# EAGLE design voce-v2b-th (EAGLE 6.6.0)
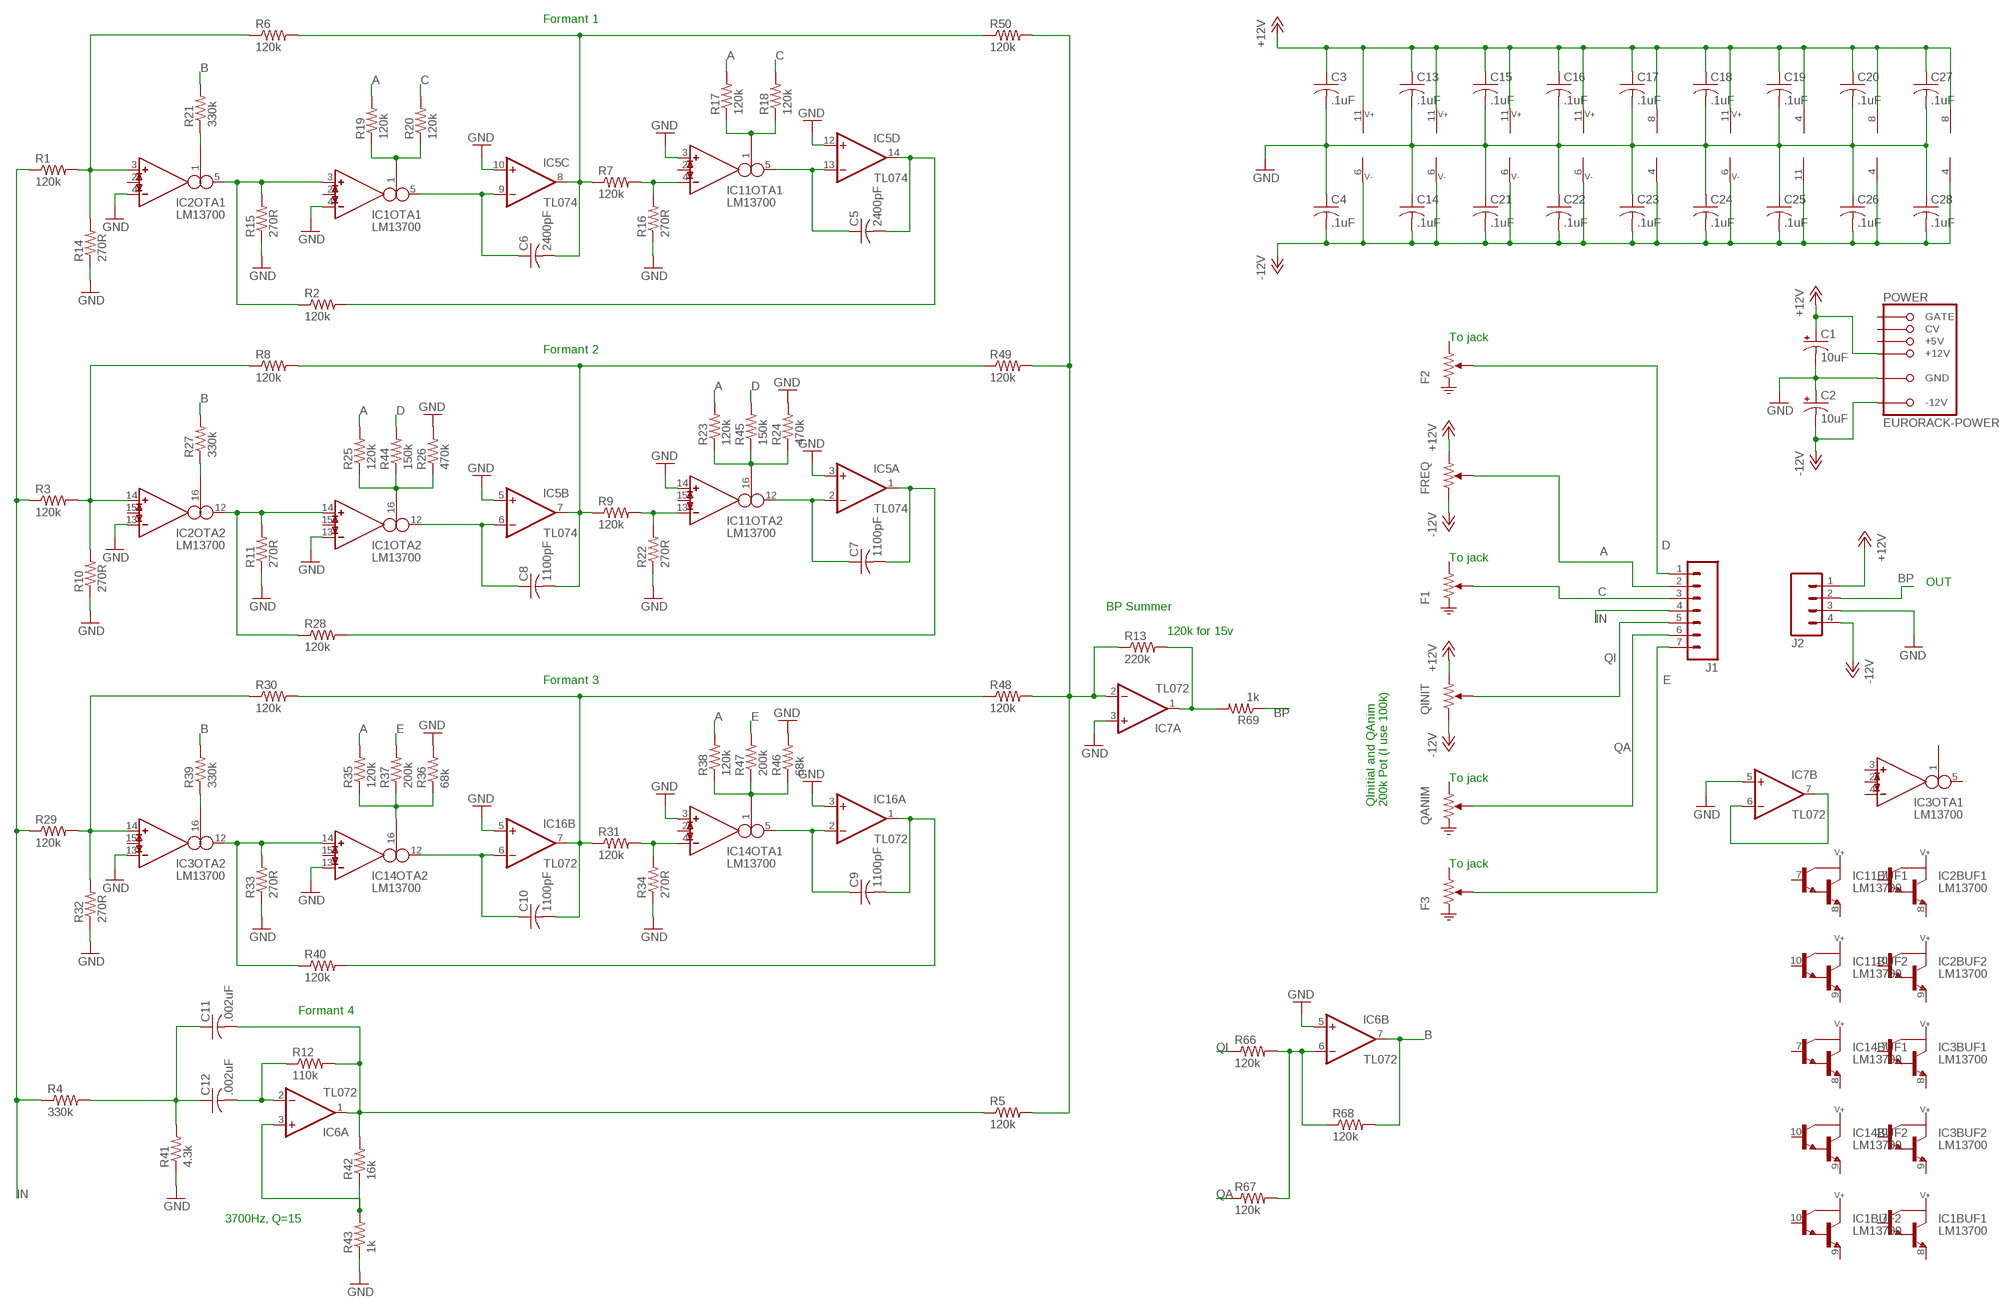
[diagram p0: schematic, sheet 1]

## Parts
C1  10uF  CPOL-USE2.5-5  [E2,5-5]
C2  10uF  CPOL-USE2.5-5  [E2,5-5]
C3  .1uF  C-US025-025X050  [C025-025X050]
C4  .1uF  C-US025-025X050  [C025-025X050]
C5  2400pF  C-US050-025X075  [C050-025X075]
C6  2400pF  C-US050-025X075  [C050-025X075]
C7  1100pF  C-US050-025X075  [C050-025X075]
C8  1100pF  C-US050-025X075  [C050-025X075]
C9  1100pF  C-US050-025X075  [C050-025X075]
C10  1100pF  C-US050-025X075  [C050-025X075]
C11  .002uF  C-US050-025X075  [C050-025X075]
C12  .002uF  C-US050-025X075  [C050-025X075]
C13  .1uF  C-US025-025X050  [C025-025X050]
C14  .1uF  C-US025-025X050  [C025-025X050]
C15  .1uF  C-US025-025X050  [C025-025X050]
C16  .1uF  C-US025-025X050  [C025-025X050]
C17  .1uF  C-US025-025X050  [C025-025X050]
C18  .1uF  C-US025-025X050  [C025-025X050]
C19  .1uF  C-US025-025X050  [C025-025X050]
C20  .1uF  C-US025-025X050  [C025-025X050]
C21  .1uF  C-US025-025X050  [C025-025X050]
C22  .1uF  C-US025-025X050  [C025-025X050]
C23  .1uF  C-US025-025X050  [C025-025X050]
C24  .1uF  C-US025-025X050  [C025-025X050]
C25  .1uF  C-US025-025X050  [C025-025X050]
C26  .1uF  C-US025-025X050  [C025-025X050]
C27  .1uF  C-US025-025X050  [C025-025X050]
C28  .1uF  C-US025-025X050  [C025-025X050]
F1  POT-ATTEN  (no package)
F2  POT-ATTEN  (no package)
F3  POT-ATTEN  (no package)
FREQ  POT  (no package)
IC1  LM13700  LM13700N  [DIL16]
IC2  LM13700  LM13700N  [DIL16]
IC3  LM13700  LM13700N  [DIL16]
IC5  TL074  TL074P  [DIL14]
IC6  TL072  TL072P  [DIL08]
IC7  TL072  TL072P  [DIL08]
IC11  LM13700  LM13700N  [DIL16]
IC14  LM13700  LM13700N  [DIL16]
IC16  TL072  TL072P  [DIL08]
J1  M07LONGPADS  [1X07_LONGPADS]
J2  M04LONGPADS  [1X04_LONGPADS]
POWER  EURORACK-POWER  [PINSHRD_PTH_2X8]
QANIM  POT-ATTEN  (no package)
QINIT  POT  (no package)
R1  120k  R-US_0204/2V  [0204V]
R2  120k  R-US_0204/2V  [0204V]
R3  120k  R-US_0204/2V  [0204V]
R4  330k  R-US_0204/2V  [0204V]
R5  120k  R-US_0204/2V  [0204V]
R6  120k  R-US_0204/2V  [0204V]
R7  120k  R-US_0204/2V  [0204V]
R8  120k  R-US_0204/2V  [0204V]
R9  120k  R-US_0204/2V  [0204V]
R10  270R  R-US_0204/2V  [0204V]
R11  270R  R-US_0204/2V  [0204V]
R12  110k  R-US_0204/2V  [0204V]
R13  220k  R-US_0204/2V  [0204V]
R14  270R  R-US_0204/2V  [0204V]
R15  270R  R-US_0204/2V  [0204V]
R16  270R  R-US_0204/2V  [0204V]
R17  120k  R-US_0204/2V  [0204V]
R18  120k  R-US_0204/2V  [0204V]
R19  120k  R-US_0204/2V  [0204V]
R20  120k  R-US_0204/2V  [0204V]
R21  330k  R-US_0204/2V  [0204V]
R22  270R  R-US_0204/2V  [0204V]
R23  120k  R-US_0204/2V  [0204V]
R24  470k  R-US_0204/2V  [0204V]
R25  120k  R-US_0204/2V  [0204V]
R26  470k  R-US_0204/2V  [0204V]
R27  330k  R-US_0204/2V  [0204V]
R28  120k  R-US_0204/2V  [0204V]
R29  120k  R-US_0204/2V  [0204V]
R30  120k  R-US_0204/2V  [0204V]
R31  120k  R-US_0204/2V  [0204V]
R32  270R  R-US_0204/2V  [0204V]
R33  270R  R-US_0204/2V  [0204V]
R34  270R  R-US_0204/2V  [0204V]
R35  120k  R-US_0204/2V  [0204V]
R36  68k  R-US_0204/2V  [0204V]
R37  200k  R-US_0204/2V  [0204V]
R38  120k  R-US_0204/2V  [0204V]
R39  330k  R-US_0204/2V  [0204V]
R40  120k  R-US_0204/2V  [0204V]
R41  4.3k  R-US_0204/2V  [0204V]
R42  16k  R-US_0204/2V  [0204V]
R43  1k  R-US_0204/2V  [0204V]
R44  150k  R-US_0204/2V  [0204V]
R45  150k  R-US_0204/2V  [0204V]
R46  68k  R-US_0204/2V  [0204V]
R47  200k  R-US_0204/2V  [0204V]
R48  120k  R-US_0204/2V  [0204V]
R49  120k  R-US_0204/2V  [0204V]
R50  120k  R-US_0204/2V  [0204V]
R66  120k  R-US_0204/2V  [0204V]
R67  120k  R-US_0204/2V  [0204V]
R68  120k  R-US_0204/2V  [0204V]
R69  1k  R-US_0204/2V  [0204V]

## Nets
+12V: C1.+ C3.1 C13.1 C15.1 C16.1 C17.1 C18.1 C19.1 C20.1 C27.1 FREQ.1 IC1.11 IC2.11 IC3.11 IC5.4(P:V+) IC6.8(P:V+) IC7.8(P:V+) IC11.11 IC14.11 IC16.8(P:V+) J2.1 POWER.+12V@1(+12V) POWER.+12V@2(+12V) QINIT.1
-12V: C2.- C4.2 C14.2 C21.2 C22.2 C23.2 C24.2 C25.2 C26.2 C28.2 FREQ.3 IC1.6 IC2.6 IC3.6 IC5.11(P:V-) IC6.4(P:V-) IC7.4(P:V-) IC11.6 IC14.6 IC16.4(P:V-) J2.4 POWER.-12V@1(-12V) POWER.-12V@2(-12V) QINIT.3
A: FREQ.2 J1.2 R17.2 R19.2 R23.2 R25.2 R35.2 R38.2
B: IC6.7(B:OUT) R21.2 R27.2 R39.2 R68.2
BP: J2.2 R69.1
C: F1.2 J1.3 R18.2 R20.2
D: F2.2 J1.1 R44.2 R45.2
E: F3.2 J1.7 R37.2 R47.2
GND: C1.- C2.+ C3.2 C4.1 C13.2 C14.1 C15.2 C16.2 C17.2 C18.2 C19.2 C20.2 C21.1 C22.1 C23.1 C24.1 C25.1 C26.1 C27.2 C28.1 IC1.4(OTA1:IN_N) IC1.13(OTA2:IN_N) IC2.4(OTA1:IN_N) IC2.13(OTA2:IN_N) IC3.13(OTA2:IN_N) IC5.3(A:+IN) IC5.5(B:+IN) IC5.10(C:+IN) IC5.12(D:+IN) IC6.5(B:+IN) IC7.3(A:+IN) IC7.5(B:+IN) IC11.3(OTA1:IN_P) IC11.14(OTA2:IN_P) IC14.3(OTA1:IN_P) IC14.13(OTA2:IN_N) IC16.3(A:+IN) IC16.5(B:+IN) J2.3 POWER.GND@1(GND) POWER.GND@2(GND) POWER.GND@3(GND) POWER.GND@4(GND) POWER.GND@5(GND) POWER.GND@6(GND) R10.1 R11.1 R14.1 R15.1 R16.1 R22.1 R24.2 R26.2 R32.1 R33.1 R34.1 R36.2 R41.1 R43.1 R46.2
IN: J1.4 R1.1 R3.1 R4.1 R29.1
N$1: IC1.3(OTA1:IN_P) IC2.5(OTA1:OUT) R2.1 R15.2
N$2: C6.1 IC1.5(OTA1:OUT) IC5.9(C:-IN)
N$3: IC2.3(OTA1:IN_P) R1.2 R6.1 R14.2
N$4: IC2.1(OTA1:I_BIAS) R21.1
N$5: IC11.4(OTA1:IN_N) R7.2 R16.2
N$6: C11.2 IC6.1(A:OUT) R5.1 R12.2 R42.2
N$7: C6.2 IC5.8(C:OUT) R6.2 R7.1 R50.1
N$8: IC7.6(B:-IN) IC7.7(B:OUT)
N$9: IC1.1(OTA1:I_BIAS) R19.1 R20.1
N$10: C5.1 IC5.13(D:-IN) IC11.5(OTA1:OUT)
N$11: C5.2 IC5.14(D:OUT) R2.2
N$12: IC11.1(OTA1:I_BIAS) R17.1 R18.1
N$13: IC1.14(OTA2:IN_P) IC2.12(OTA2:OUT) R11.2 R28.1
N$14: C8.1 IC1.12(OTA2:OUT) IC5.6(B:-IN)
N$15: IC2.14(OTA2:IN_P) R3.2 R8.1 R10.2
N$16: C8.2 IC5.7(B:OUT) R8.2 R9.1 R49.1
N$17: IC2.16(OTA2:I_BIAS) R27.1
N$18: IC11.13(OTA2:IN_N) R9.2 R22.2
N$19: IC1.16(OTA2:I_BIAS) R25.1 R26.1 R44.1
N$20: IC14.16(OTA2:I_BIAS) R35.1 R36.1 R37.1
N$21: C7.1 IC5.2(A:-IN) IC11.12(OTA2:OUT)
N$22: C7.2 IC5.1(A:OUT) R28.2
N$23: IC14.1(OTA1:I_BIAS) R38.1 R46.1 R47.1
N$24: IC3.12(OTA2:OUT) IC14.14(OTA2:IN_P) R33.2 R40.1
N$25: C10.1 IC14.12(OTA2:OUT) IC16.6(B:-IN)
N$26: IC3.14(OTA2:IN_P) R29.2 R30.1 R32.2
N$27: C10.2 IC16.7(B:OUT) R30.2 R31.1 R48.1
N$28: IC3.16(OTA2:I_BIAS) R39.1
N$29: IC14.4(OTA1:IN_N) R31.2 R34.2
N$32: C9.1 IC14.5(OTA1:OUT) IC16.2(A:-IN)
N$33: C9.2 IC16.1(A:OUT) R40.2
N$35: IC7.2(A:-IN) R5.2 R13.1 R48.2 R49.2 R50.2
N$36: IC7.1(A:OUT) R13.2 R69.2
N$37: C12.2 IC6.2(A:-IN) R12.1
N$38: IC6.3(A:+IN) R42.1 R43.2
N$41: C11.1 C12.1 R4.2 R41.2
N$49: IC6.6(B:-IN) R66.2 R67.2 R68.1
N$65: IC11.16(OTA2:I_BIAS) R23.1 R24.1 R45.1
QA: J1.6 QANIM.2 R67.1
QI: J1.5 QINIT.2 R66.1
Unconnected: F1.1 F2.1 F3.1 IC1.2(OTA1:I_DIODE) IC1.7(BUF1:B) IC1.8(BUF1:E) IC1.9(BUF2:E) IC1.10(BUF2:B) IC1.15(OTA2:I_DIODE) IC2.2(OTA1:I_DIODE) IC2.7(BUF1:B) IC2.8(BUF1:E) IC2.9(BUF2:E) IC2.10(BUF2:B) IC2.15(OTA2:I_DIODE) IC3.1(OTA1:I_BIAS) IC3.2(OTA1:I_DIODE) IC3.3(OTA1:IN_P) IC3.4(OTA1:IN_N) IC3.5(OTA1:OUT) IC3.7(BUF1:B) IC3.8(BUF1:E) IC3.9(BUF2:E) IC3.10(BUF2:B) IC3.15(OTA2:I_DIODE) IC11.2(OTA1:I_DIODE) IC11.7(BUF1:B) IC11.8(BUF1:E) IC11.9(BUF2:E) IC11.10(BUF2:B) IC11.15(OTA2:I_DIODE) IC14.2(OTA1:I_DIODE) IC14.7(BUF1:B) IC14.8(BUF1:E) IC14.9(BUF2:E) IC14.10(BUF2:B) IC14.15(OTA2:I_DIODE) POWER.+5V@1(+5V) POWER.+5V@2(+5V) POWER.CV@1(CV) POWER.CV@2(CV) POWER.GATE@1(GATE) POWER.GATE@2(GATE) QANIM.1

## Notes on the sheet
- Formant 1
- To jack
- Formant 2
- To jack
- OUT
- BP Summer
- 120k for 15v
- Formant 3
- To jack
- QInitial and QAnim
  200k Pot (I use 100k)
- To jack
- Formant 4
- 3700Hz, Q=15

## Library data of the parts
C1 C2 = rcl:CPOL-US: POLARIZED CAPACITOR, American symbol
C3-C28 = rcl:C-US: CAPACITOR, American symbol
F1-F3 QANIM = mmoretti:POT-ATTEN
FREQ QINIT = mmoretti:POT
IC1-IC3 IC11 IC14 = mmoretti:LM13700: Dual OTA with buffers
IC5 = mmoretti:TL074: OP AMP
IC6 IC7 IC16 = mmoretti:TL072: OP AMP
J1 = SparkFun-Connectors:M07: Header 7 Standard 7-pin 0.1" header. Use with straight break away headers (SKU : PRT-00116), right angle break away headers (PRT-00553), swiss pins (PRT-00743), machine pins (PRT-00117), and female headers (PRT-00115). NOTES ON THE VARIANTS LOCK and LOCK_LONGPADS... This footprint was designed to help hold the alignment of a through-hole component (i.e. 7-pin header) while soldering it into place. You may notice that each hole has been shifted either up or down by 0.005 of an inch from it's more standard position (which is usually a perfectly straight line). This slight alteration caused the pins (the squares in the middle) to touch the edges of the holes. Because they are alternating, it causes a "brace" to hold the header in place. 0.005 has proven to be the perfect amount of "off-center" position when using our standard breakaway headers. Although looks a little odd when you look at the bare footprint, once you have a header in there, the alteration is very hard to notice. Also, if you push a header all the way into place, it is covered up entirely on the bottom side. This idea of altering the position of holes to aid alignment will be further integrated into the Sparkfun Library for other footprints. It can help hold any component with 3 or more connection pins.
J2 = SparkFun-Connectors:M04: Header 4 Standard 4-pin 0.1" header. Use with straight break away headers (SKU : PRT-00116), right angle break away headers (PRT-00553), swiss pins (PRT-00743), machine pins (PRT-00117), and female headers (PRT-00115). Molex polarized connector foot print use with SKU : PRT-08231 with associated crimp pins and housings. 1MM SMD Version SKU: PRT-10208
POWER = mmoretti:EURORACK-POWER
R1-R50 R66-R69 = rcl:R-US_: RESISTOR, American symbol

## Board
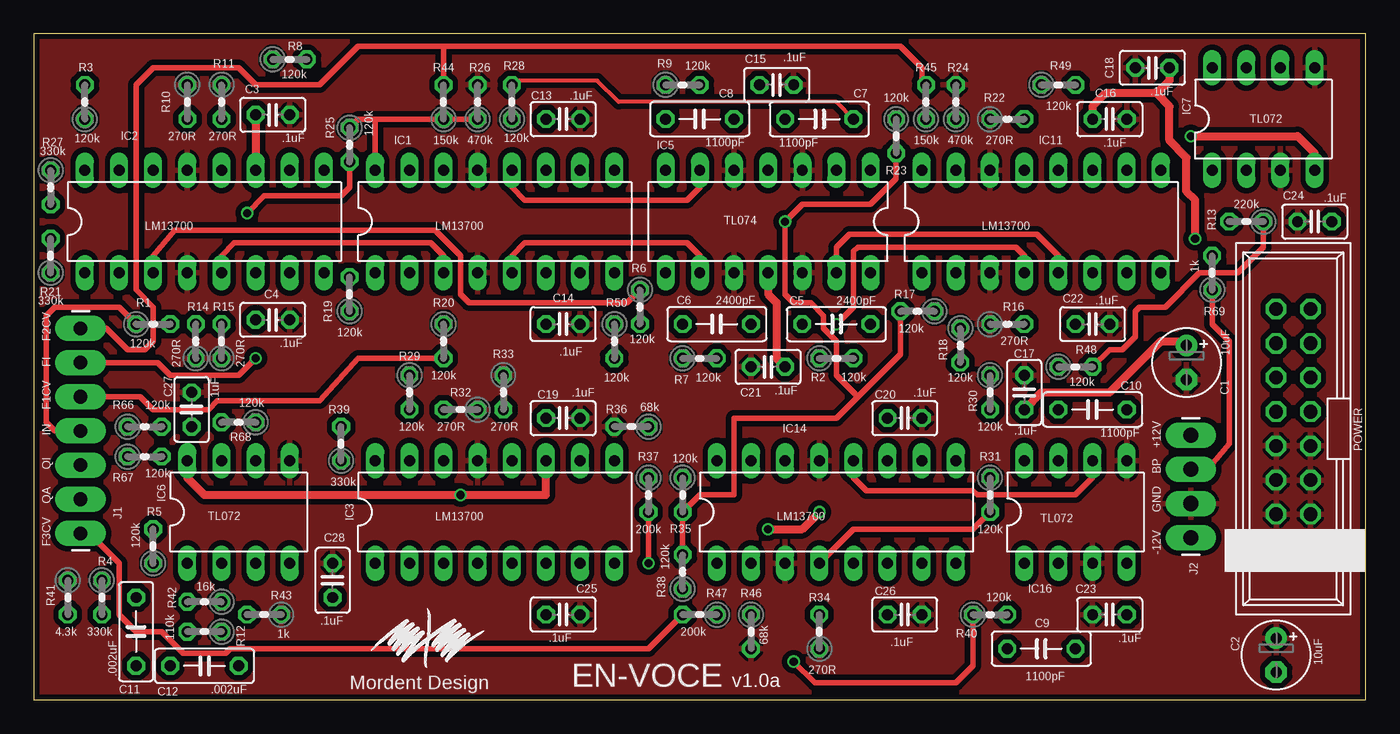
[diagram p1: board, top side]
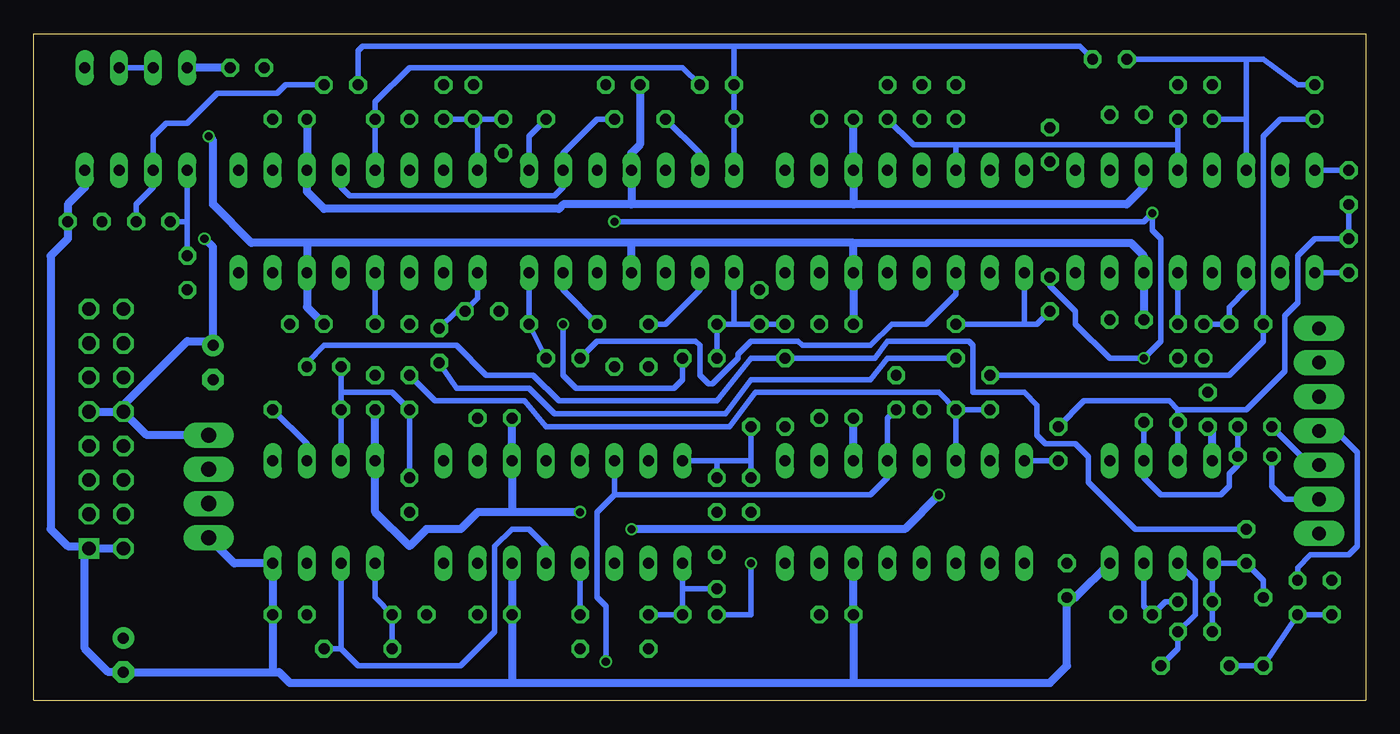
[diagram p2: board, bottom side, seen from below]

Size 99.06 x 49.53 mm. Coordinates in mm from the lower left corner, seen from the top.
Outline: 99.06,0 99.06,49.53 0,49.53 0,0 99.06,0
Copper layers (1*16): Top 0.035mm / dielectric 1.5mm / Bottom 0.035mm
Design rules "SeeedStudio_2layer_DRU_no_angle_20140221": minimum track width 6mil, minimum drill 12mil, track to track 6mil, track to pad 6mil, pad to pad 6mil, via to via 6mil, smd to smd 0mil, copper to edge 10mil, drill to drill 10mil, minimum pad ring 10mil, minimum via ring 6mil, stop-mask expansion 2mil, vias tented up to drill 100mil, thermal gap 10mil

### Footprints (pad centres in the part's own frame; a part is rotated, then mirrored left to right if it is on the bottom)
E2,5-5 = drill 0.813 pad 1.6: + -1.27,0 | drill 0.813 pad 1.6 octagon: - 1.27,0
C025-025X050 = drill 0.813 octagon: 1 -1.27,0; 2 1.27,0
C050-025X075 = drill 0.813 octagon: 1 -2.54,0; 2 2.54,0
DIL16 = drill 0.813 long: 1 -8.89,-3.81; 2 -6.35,-3.81; 3 -3.81,-3.81; 4 -1.27,-3.81; 5 1.27,-3.81; 6 3.81,-3.81; 7 6.35,-3.81; 8 8.89,-3.81; 9 8.89,3.81; 10 6.35,3.81; 11 3.81,3.81; 12 1.27,3.81; 13 -1.27,3.81; 14 -3.81,3.81; 15 -6.35,3.81; 16 -8.89,3.81
DIL14 = drill 0.813 long: 1 -7.62,-3.81; 2 -5.08,-3.81; 3 -2.54,-3.81; 4 0,-3.81; 5 2.54,-3.81; 6 5.08,-3.81; 7 7.62,-3.81; 8 7.62,3.81; 9 5.08,3.81; 10 2.54,3.81; 11 0,3.81; 12 -2.54,3.81; 13 -5.08,3.81; 14 -7.62,3.81
DIL08 = drill 0.813 long: 1 -3.81,-3.81; 2 -1.27,-3.81; 3 1.27,-3.81; 4 3.81,-3.81; 5 3.81,3.81; 6 1.27,3.81; 7 -1.27,3.81; 8 -3.81,3.81
1X07_LONGPADS = drill 1.016 pad 1.88 long: 1 0,0; 2 2.54,0; 3 5.08,0; 4 7.62,0; 5 10.16,0; 6 12.7,0; 7 15.24,0
1X04_LONGPADS = drill 1.118 pad 1.88 long: 1 0,0; 2 2.54,0; 3 5.08,0; 4 7.62,0
PINSHRD_PTH_2X8 = drill 1.016 octagon: +5V@1 3.81,1.27; +5V@2 3.81,-1.27; +12V@1 1.27,1.27; +12V@2 1.27,-1.27; -12V@1 -8.89,1.27; CV@1 6.35,1.27; CV@2 6.35,-1.27; GATE@1 8.89,1.27; GATE@2 8.89,-1.27; GND@1 -6.35,1.27; GND@2 -6.35,-1.27; GND@3 -3.81,1.27; GND@4 -3.81,-1.27; GND@5 -1.27,1.27; GND@6 -1.27,-1.27 | drill 1.016 square: -12V@2 -8.89,-1.27
0204V = drill 0.813 octagon: 1 -1.27,0; 2 1.27,0

### Placement (x,y rotation side)
C1  85.72,25.08 270 top
C2  92.39,3.33 270 top
C3  17.78,43.5 0 top
C4  17.78,28.26 180 top
C5  59.69,27.94 0 top
C6  50.8,27.94 180 top
C7  58.42,43.18 0 top
C8  49.53,43.18 180 top
C9  74.93,3.81 180 top
C10  78.74,21.59 180 top
C11  7.62,5.08 90 top
C12  12.7,2.54 0 top
C13  39.37,43.18 0 top
C14  39.37,27.94 180 top
C15  55.24,45.72 0 top
C16  80.01,43.18 0 top
C17  73.66,22.86 90 top
C18  83.19,46.99 180 top
C19  39.37,20.95 0 top
C20  64.77,20.95 0 top
C21  54.61,24.77 0 top
C22  78.74,27.94 180 top
C23  80.01,6.35 0 top
C24  95.25,35.56 0 top
C25  39.37,6.35 180 top
C26  64.77,6.35 180 top
C27  11.75,21.59 90 top
C28  22.23,8.89 270 top
IC1  34.29,35.56 0 top
IC2  12.7,35.56 0 top
IC3  34.29,13.97 0 top
IC5  54.61,35.56 180 top
IC6  15.24,13.97 0 top
IC7  91.44,43.18 0 top
IC11  74.93,35.56 0 top
IC14  59.69,13.97 0 top
IC16  77.47,13.97 0 top
J1  3.49,27.62 270 top
J2  86.04,19.68 270 top
POWER  93.66,20.16 90 top
R1  8.89,27.94 0 top
R2  59.69,25.4 0 top
R3  3.81,44.45 90 top
R4  5.08,7.62 270 top
R5  8.89,11.43 90 top
R6  45.09,29.21 270 top
R7  49.53,25.4 0 top
R8  19.05,47.62 0 top
R9  48.26,45.72 0 top
R10  11.43,44.45 270 top
R11  13.97,44.45 270 top
R12  12.7,5.08 180 top
R13  90.17,35.56 180 top
R14  12.06,26.67 90 top
R15  13.97,26.67 90 top
R16  72.39,27.94 0 top
R17  65.72,28.89 180 top
R18  68.9,26.35 270 top
R19  23.5,30.16 90 top
R20  30.48,26.67 270 top
R21  1.27,33.02 90 top
R22  72.39,43.18 0 top
R23  64.14,41.91 270 top
R24  68.58,44.45 90 top
R25  23.5,41.27 270 top
R26  33.02,44.45 90 top
R27  1.27,38.1 270 top
R28  35.56,44.45 90 top
R29  27.94,22.86 270 top
R30  71.12,22.86 270 top
R31  71.12,15.24 270 top
R32  31.75,21.59 180 top
R33  34.92,22.86 270 top
R34  58.42,5.08 90 top
R35  48.26,15.24 270 top
R36  44.45,20.32 180 top
R37  45.72,15.24 270 top
R38  48.26,9.53 90 top
R39  22.86,19.05 90 top
R40  71.12,6.35 0 top
R41  2.54,7.62 270 top
R42  12.7,7.3 180 top
R43  17.14,6.35 180 top
R44  30.48,44.45 90 top
R45  66.36,44.45 90 top
R46  53.34,5.08 270 top
R47  49.53,6.35 180 top
R48  77.47,24.77 0 top
R49  76.2,45.72 0 top
R50  43.18,26.67 270 top
R66  8.26,20.32 0 top
R67  8.26,18.1 0 top
R68  15.24,20.64 180 top
R69  87.63,31.75 90 top

### Tracks (layer width: path | path; a pad name or v marks a point on that pad's centre or on a via)
+12V  (via drill 0.6)
  Top 0.61: C18.1 84.45,46.04 83.5,45.09 | 83.5,45.09 79.69,45.09 78.74,44.13 C16.1 | C3.1 IC2.11 | IC6.8 11.43,16.51 12.7,15.24 v31.75,15.24 38.1,15.24 IC3.11 | v54.61,12.7 57.15,12.7 v58.42,13.97 | C17.1 74.93,22.86 80.01,22.86 83.82,26.67 85.41,26.67 C1.+ | v86.36,34.29 86.36,37.15 85.72,37.78 85.72,40.32 84.45,41.59 84.45,44.13 83.5,45.09
  Bottom 0.61: POWER.+12V@2 POWER.+12V@1 | POWER.+12V@1 92.39,21.91 87.63,26.67 86.04,26.67 C1.+ 85.72,33.66 v86.36,34.29 | C16.1 IC11.11 78.74,37.78 77.47,36.51 60.01,36.51 59.69,36.83 54.61,36.83 | C18.1 IC7.8 | C15.1 53.98,41.27 54.61,40.64 IC5.4 54.61,36.83 | C13.1 IC1.11 38.1,36.83 | IC6.8 11.43,20 C27.1 | IC3.11 C19.1 | C20.1 IC14.11 63.5,13.97 | C17.1 IC16.8 73.66,13.97 71.12,11.43 69.85,12.7 67.31,12.7 66.04,13.97 63.5,13.97 | IC2.11 16.51,38.1 17.78,36.83 38.1,36.83 | 38.1,36.83 54.61,36.83 | v31.75,15.24 34.29,12.7 v54.61,12.7 | v58.42,13.97 63.5,13.97 | J2.1 90.65,19.68 POWER.+12V@1
-12V  (via drill 0.6)
  Top 0.61: IC5.11 54.61,30.16 55.24,29.53 55.24,25.4 C21.2 | v86.04,41.91 93.98,41.91 95.25,40.64 IC7.4
  Bottom 0.61: POWER.-12V@2 POWER.-12V@1 | POWER.-12V@2 95.25,10.95 95.25,3.81 93.5,2.06 C2.- 81.28,2.06 | IC14.6 C26.2 63.5,1.27 | IC3.6 C25.2 38.1,1.27 | IC6.4 21.59,7.62 C28.2 22.23,2.54 23.5,1.27 38.1,1.27 | C4.2 IC2.6 16.51,33.02 17.46,33.97 38.1,33.97 | C22.2 78.74,29.21 IC11.6 78.74,33.97 | IC7.4 95.25,38.1 96.52,36.83 C24.2 96.52,34.29 97.79,33.02 97.79,12.7 96.52,11.43 95.09,11.43 POWER.-12V@2 | 81.28,2.06 80.8,2.06 80.01,1.27 63.5,1.27 | 81.28,2.06 C23.2 IC16.4 84.14,10.16 J2.4 | 63.5,1.27 38.1,1.27 | C14.2 IC1.6 38.1,33.97 | 38.1,33.97 54.61,33.97 | 54.61,33.97 78.74,33.97 | 78.74,33.97 82.87,33.97 85.72,36.83 85.72,41.59 v86.04,41.91 | IC5.11 54.61,33.97
A  (via drill 0.6)
  Top 0.406: J1.2 9.21,25.08 10.16,24.13 15.24,24.13 v16.51,25.4 | R17.2 64.45,25.72 61.28,22.54 | 61.28,22.54 59.69,20.95 52.07,20.95 52.07,15.24 49.53,15.24 R35.2 R38.2 | R25.2 23.5,38.1 22.86,37.47 17.14,37.47 v15.88,36.2 | R23.2 64.14,38.73 62.23,36.83 57.15,36.83 v55.88,35.56 55.88,30.16 56.52,29.53 57.78,29.53 58.74,28.57 58.74,27.62 59.69,26.67 59.69,24.13 61.28,22.54
  Bottom 0.406: R19.2 23.5,30.8 21.59,28.89 21.59,27.94 19.05,25.4 v16.51,25.4 15.24,26.67 15.24,34.29 15.88,34.92 v15.88,36.2 16.51,35.56 v55.88,35.56
B
  Bottom 0.406: R27.2 R21.2 3.81,34.29 5.08,33.02 5.08,29.53 6.03,28.57 6.03,24.45 8.89,21.59 13.97,21.59 | IC6.7 R68.2 13.97,21.59 | R39.2 20.95,22.23 14.61,22.23 13.97,21.59
BP
  Top 0.406: R69.1 87.63,27.94 88.9,26.67 88.9,19.05 87.31,17.14 J2.2
C
  Top 0.406: J1.3 7.94,22.54 8.89,21.59 13.02,21.59 13.65,22.23 21.27,22.23 24.13,25.4 R20.2
  Bottom 0.406: R18.2 67.63,23.18 62.23,23.18 60.33,21.27 47.62,21.27 45.72,23.81 36.83,23.81 35.56,25.4 R20.2
D
  Top 0.406: 30.48,48.58 24.13,48.58 21.27,45.72 16.51,45.72 15.24,46.99 8.89,46.99 7.62,45.72 7.62,30.48 8.89,29.21 8.89,26.67 8.26,26.04 6.99,26.04 5.4,27.62 J1.1 | 30.48,48.58 64.45,48.58 66.04,46.99 66.04,46.04 R45.2 | R44.2 30.48,48.58
E  (via drill 0.6)
  Top 0.406: J1.7 4.13,12.38 6.35,10.16 6.35,6.35 7.62,5.08 9.53,5.08 11.11,3.49 14.29,3.49 14.61,3.81 45.72,3.81 R47.2 | v45.72,10.16 R37.2
  Bottom 0.406: R47.2 45.72,6.35 v45.72,10.16
GND
  pour Top (isolate 0.406): 0,49.53 99.06,49.53 99.06,0 0,0
IN
  Top 0.406: R1.1 6.35,29.21 1.59,29.21 0.95,28.57 0.95,20.64 1.59,20 J1.4
  Bottom 0.406: J1.4 2.22,20 0.64,18.41 0.64,11.43 1.27,10.79 4.13,10.79 5.08,9.84 R4.1 | R3.1 6.35,43.18 7.62,41.91 R1.1 7.62,26.67 10.16,24.13 R29.1
N$1
  Top 0.406: IC2.5 13.97,33.02 14.92,33.97 29.53,33.97 30.48,33.02 IC1.3
  Bottom 0.406: IC2.5 R15.2 | IC1.3 30.48,30.16 32.7,27.94 35.24,27.94 36.83,26.35 41.91,26.35 42.23,26.67 45.72,26.67 46.67,25.72 46.67,25.4 48.58,23.5 48.9,23.5 49.53,24.13 49.53,26.35 49.85,26.67 57.15,26.67 R2.1
N$2
  Top 0.406: IC1.5 35.56,33.02 36.51,33.97 48.58,33.97 49.53,33.02 IC5.9
  Bottom 0.406: IC5.9 49.53,30.48 52.07,27.94 C6.1
N$3
  Top 0.406: IC2.3 8.89,33.02 10.48,34.92 29.84,34.92 31.75,33.02 31.75,30.16 32.38,29.53 44.13,29.53 R6.1
  Bottom 0.406: R14.2 R1.2 10.16,29.21 8.89,30.48 IC2.3
N$4
  Bottom 0.406: R21.1 IC2.1
N$5  (via drill 0.6)
  Top 0.406: IC11.4 73.66,33.02 73.03,33.66 61.28,33.66 60.96,33.34 60.96,29.21 v59.69,27.94
  Bottom 0.406: R16.2 IC11.4 | R7.2 50.8,23.81 51.44,23.18 58.74,23.18 59.69,24.13 v59.69,27.94
N$6
  Bottom 0.406: C11.2 7.62,8.89 R5.1 IC6.1 R42.2 R12.2
N$7
  Bottom 0.406: 46.99,27.94 R6.2 R50.1 | 46.99,27.94 C6.2 R7.1 | IC5.8 46.99,27.94
N$8
  Bottom 0.406: IC7.7 IC7.6
N$9
  Bottom 0.406: R20.1 25.4,27.94 | 25.4,27.94 24.45,27.94 R19.1 | IC1.1 25.4,27.94
N$10
  Top 0.406: IC5.13 59.69,33.66 60.64,34.61 74.61,34.61 76.2,33.02 IC11.5
  Bottom 0.406: IC5.13 59.69,30.48 C5.1
N$11
  Bottom 0.406: IC5.14 C5.2 R2.2
N$12
  Bottom 0.406: R18.1 67.63,28.89 R17.1 66.04,29.84 IC11.1
N$13
  Bottom 0.406: IC2.12 13.97,41.27 | 13.97,41.27 R11.2 | R28.1 33.66,41.27 30.48,41.27 | 30.48,41.27 13.97,41.27 | IC1.14 30.48,41.27
N$14
  Top 0.406: IC1.12 35.56,38.1 36.51,37.15 48.58,37.15 49.53,38.1 IC5.6
  Bottom 0.406: C8.1 49.53,40.64 IC5.6
N$15
  Bottom 0.406: R3.2 5.08,45.72 7.62,47.62 8.89,47.62 | 8.89,47.62 R8.1 | 8.89,47.62 8.89,43.18 | 8.89,43.18 IC2.14 | R10.2 8.89,43.18
N$16
  Bottom 0.406: 46.99,48.58 R9.1 C8.2 IC5.7 | 46.99,48.58 74.61,48.58 74.93,48.26 R49.1 | 46.99,48.58 21.27,48.58 R8.2
N$17
  Bottom 0.406: IC2.16 R27.1
N$18
  Bottom 0.406: IC11.13 R22.2 73.66,44.45 71.12,46.99 50.8,46.99 R9.2
N$19
  Top 0.406: R26.1 R44.1 25.4,43.18 | 25.4,43.18 24.13,43.18 R25.1 | IC1.16 25.4,43.18
N$20
  Bottom 0.406: R36.1 45.72,17.78 | 45.72,17.78 R37.1 | IC14.16 48.26,17.78 | 48.26,17.78 45.72,17.78 | R35.1 48.26,17.78
N$21
  Bottom 0.406: C7.1 57.15,43.18 59.69,40.64 IC5.2 59.69,38.1 60.33,37.47 75.56,37.47 76.2,38.1 IC11.12
N$22
  Top 0.305: C7.2 59.69,44.45 43.5,44.45 41.91,46.04 35.88,46.04 R28.2
  Bottom 0.406: IC5.1 62.23,41.91 C7.2
N$23
  Bottom 0.406: 50.8,8.26 R47.1 R46.1 | 50.8,8.26 IC14.1 | R38.1 50.8,8.26
N$24  (via drill 0.6)
  Top 0.406: R40.1 69.85,2.54 68.58,1.27 58.1,1.27 v56.52,2.86
  Bottom 0.406: 55.88,15.24 36.83,15.24 35.56,16.51 IC3.12 35.56,20.95 R33.2 | IC14.14 55.88,15.24 | v56.52,2.86 56.52,6.99 57.15,7.62 57.15,13.97 55.88,15.24
N$25
  Top 0.406: IC14.12 60.96,16.51 61.91,15.56 69.85,15.56 70.17,15.24 77.47,15.24 78.74,16.51 IC16.6
  Bottom 0.406: IC16.6 78.74,19.05 C10.1
N$26
  Bottom 0.406: R32.2 IC3.14 | R32.2 R29.2 | R32.2 31.75,22.86 45.4,22.86 47.31,20.32 60.96,20.32 62.55,22.23 69.22,22.23 R30.1
N$27
  Bottom 0.406: IC16.7 C10.2 76.2,22.86 | R31.1 R30.2 72.39,22.86 76.2,22.86 | 76.2,22.86 R48.1
N$28
  Bottom 0.406: R39.1 IC3.16
N$29
  Top 0.406: IC14.4 60.96,12.7 69.85,12.7 R31.2
  Bottom 0.406: R34.2 IC14.4
N$32
  Bottom 0.406: IC16.2 76.2,3.81 | 76.2,3.81 74.93,2.54 67.31,2.54 64.77,5.08 64.77,11.43 63.5,12.7 62.23,12.7 60.96,11.43 IC14.5 | C9.1 76.2,3.81
N$33
  Bottom 0.406: C9.2 R40.2 73.66,7.62 IC16.1
N$35
  Top 0.406: R13.1 91.44,33.66 89.53,31.75 86.68,31.75 84.14,29.21 82.23,29.21 81.92,28.89 81.92,26.99 80.96,26.04 80.01,26.04 R48.2
  Bottom 0.406: R5.2 17.14,12.7 20.64,16.19 20.64,18.1 21.59,19.05 23.81,19.05 24.45,19.68 24.45,21.91 25.4,22.86 29.21,22.86 29.21,26.35 29.53,26.67 35.56,26.67 36.51,25.4 R50.2 45.72,25.4 48.26,22.23 60.01,22.23 61.91,24.13 65.41,24.13 67.63,26.35 77.47,26.35 78.74,25.08 R48.2 | R49.2 80.33,45.72 80.96,45.09 85.41,45.09 87.63,42.86 89.22,42.86 90.17,41.91 IC7.2 90.17,38.1 91.44,36.83 R13.1
N$36
  Bottom 0.406: R69.2 87.63,35.56 | 87.63,35.56 R13.2 | 87.63,35.56 IC7.1
N$37
  Bottom 0.406: C12.2 13.97,3.81 R12.1 12.7,6.35 12.7,8.89 IC6.2
N$38
  Bottom 0.406: R42.1 14.92,7.3 R43.2 16.51,6.99 IC6.3
N$41
  Bottom 0.406: R41.2 R4.2 C11.1 C12.1
N$49
  Bottom 0.406: R68.1 IC6.6 16.51,16.51 15.24,15.24 10.79,15.24 10.16,15.88 10.16,16.83 9.53,17.46 R67.2 R66.2
N$65
  Bottom 0.406: R23.1 R45.1 | R45.1 R24.1 | IC11.16 66.04,42.86 R45.1
QA
  Bottom 0.406: J1.6 6.03,14.92 6.99,15.88 R67.1
QI
  Bottom 0.406: J1.5 4.13,17.46 R66.1

### Text on the board
tPlace: F2CV | FI | F1CV | IN | +12V | QI | BP | QA | GND | F3CV | -12V | Mordent Design | EN-VOCE | v1.0a